# Altium project ANE_0002_01AA.PrjPCB (part 4 of 4)

## Sheet Battery_Charger.SchDoc
size A3; DocumentNumber: 9; SheetNumber: 9; SheetTotal: 11
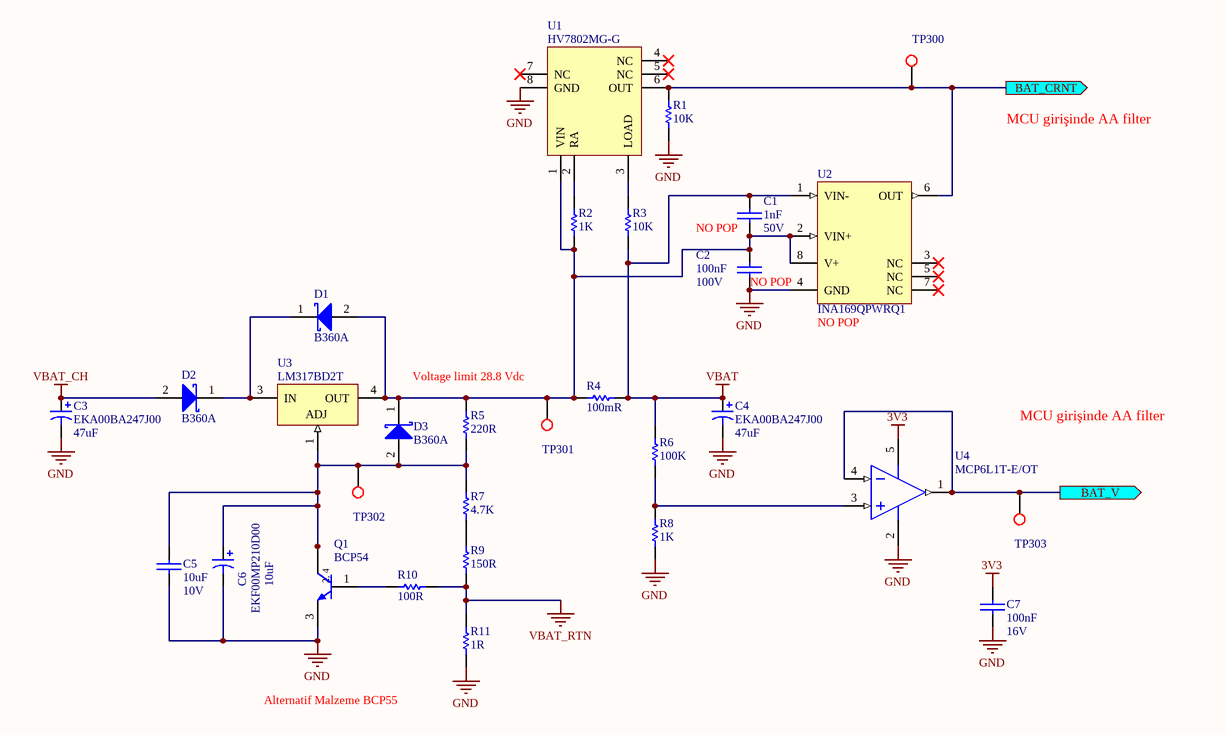
[diagram p10: Battery_Charger.SchDoc]

### Parts
C1  Operating Voltage: 50V  Assembly: NO POP  [CAPC1005X06N]  (hidden comment: 1nF)
C2  Operating Voltage: 100V  Assembly: NO POP  [CAPC3216X09N]  (hidden comment: 100nF)
C3  EKA00BA247J00  value 47uF  [CAPPR2.5-6.3X11]
C4  EKA00BA247J00  value 47uF  [CAPPR2.5-6.3X11]
C5  Operating Voltage: 10V  [CAPC2012X09N]  (hidden comment: 10uF)
C6  EKF00MP210D00  value 10uF  [CAPPR1.5-4X5]
C7  Operating Voltage: 16V  [CAPC1005X06N]  (hidden comment: 100nF)
D1  B360A  [DIOM5226X23N]
D2  B360A  [DIOM5226X23N]
D3  B360A  [DIOM5226X23N]
Q1  BCP54  [SOT-223B_N]
R1  10K  [RESC1005X04N]
R2  1K  [RESC1005X04N]
R3  10K  [RESC1005X04N]
R4  100mR  [RESC3216X08N]
R5  220R  [RESC2012X07N]
R6  100K  [RESC1005X04N]
R7  4.7K  [RESC2012X07N]
R8  1K  [RESC1005X04N]
R9  150R  [RESC2012X07N]
R10  100R  [RESC2012X07N]
R11  1R  [RESC3225X06N]
TP300  AEMT-C00S-1000-0000  [TP100]  (value not drawn)
TP301  AEMT-C00S-1000-0000  [TP100]  (value not drawn)
TP302  AEMT-C00S-1000-0000  [TP100]  (value not drawn)
TP303  AEMT-C00S-1000-0000  [TP100]  (value not drawn)
U1  HV7802MG-G  [MSOP65P490X110-8N]
U2  Assembly: NO POP  [TSOP65P640X120-8N]  (hidden comment: INA169QPWRQ1)
U3  LM317BD2T  [936-03]
U4  MCP6L1T-E/OT  [SOT-23-OT5_N]

### Ports
BAT_CRNT (out), BAT_V (out)

### Nets
3V3: C7.2 U4.5(VDD)
GND: C2.1 C3.2 C4.2 C5.1 C6.2 C7.1 Q1.3(E) R1.1 R8.1 R11.1 U1.8(GND) U2.4(GND) U4.2(VSS)
VBAT: C1.2 C4.1 R3.1 R4.2 R6.2 U2.1(VIN-)
VBAT_CH: C3.1 D2.2(A)
VBAT_RTN: R9.1 R10.2 R11.2
BAT_CRNT: R1.2 TP300.1 U1.6(OUT) U2.6(OUT) ; port BAT_CRNT
BAT_V: TP303.1 U4.1(VOUT) U4.4(VIN-) ; port BAT_V
NetC1_1: C1.1 C2.2 D1.2(A) D3.1(K) R2.1 R4.1 R5.2 TP301.1 U1.1(VIN) U2.2(VIN+) U2.8(V+) U3.4(OUT)
NetC5_2: C5.2 C6.1 D3.2(A) Q1.2(C) Q1.4(C) R5.1 R7.2 TP302.1 U3.1(ADJ)
NetD1_1: D1.1(K) D2.1(K) U3.3(IN)
NetQ1_1: Q1.1(B) R10.1
NetR2_2: R2.2 U1.2(RA)
NetR3_2: R3.2 U1.3(LOAD)
NetR6_1: R6.1 R8.2 U4.3(VIN+)
NetR7_1: R7.1 R9.2

Not connected (* = marked no-connect by the designer): U1 4(NC)* 5(NC)* 7(NC)*; U2 3(NC)* 5(NC)* 7(NC)*

### Notes on the sheet
- MCU girişinde AA filter
- Voltage limit 28.8 Vdc
- Alternatif Malzeme BCP55
- Title
- Size:
- Date:
- A3
- Number:
- Time:
- Revision:
- Sheet
- of
- File:
- (in symbol BCP54) 2, 4

### Library data of the parts
C1 = ACC0-0100-S272-0000: CAP, CER, C0G, 1nF, %5, 50V, 0402; Manufacturer: Murata; Manufacturer Part Number: GRM1555C1H102JA01D; CR: 000049; Requested by: MU; Lead Finish: Pb Free; Material: Ceramic, C0G; Definition Date: 14.08.2012; Revision Date: *; Price: *; Supplier: *; Supplier Part Number: *; DS: 000049; Operating Temp: -55 to 125 C; Storage Temp: -55 to 125 C; Status: Active; Package Reference: EIA 0402, Metric 1005; Component Type: Capacitor; Footprint Type: SMD; Published by: MU; ESR: *; FR: *; Value: 1nF
C2 = ACC7-2100-S791-0000: CAP, CER, X7R, 100nF, %10, 100V, 1206; Manufacturer: KEMET; Manufacturer Part Number: C1206C104K1RACTU; CR: 000211/89; Requested by: OO; DS: 000211; Lead Finish: Pb Free; Published by: MU; Material: Ceramic, X7R; Definition Date: 18.02.2013; Revision Date: *; Price: *; Supplier: *; Supplier Part Number: *; Operating Temp: -55 to 125 C; Storage Temp: -55 to 125 C; Status: Active; Package Reference: EIA 1206, Metric 3216; Component Type: Capacitor; Footprint Type: SMD; ESR: *; FR: *; Value: 100nF
C3 C4 = EKA00BA247J00: Aluminum Electrolytic Capacitor, Radial Style with Long Leads: 47uF, 63V; Note: Refer to Manufacturer's Data Sheets for other lead formations; DrillSize: Nominal, Rounded To The Nearest 0.1mm; Published: 19-Mar-2004; DatasheetDocument: 20-Feb-2001; PackageReference: CAPPR2.5-6.3X11; Publisher: Altium Limited; ComponentLink1Description: Manufacturer Link; ComponentLink1URL: http://www.vishay.com/; ComponentLink2Description: Datasheet; ComponentLink2URL: http://www.vishay.com/docs/25014/eka.pdf
C5 = ACC7-4100-S431-0000: CAP, CER, X7R, 10uF, %10, 10V, 0805; Manufacturer: Murata; Manufacturer Part Number: GRM21BR71A106KE51L; CR: 000049; Requested by: MAY; Lead Finish: Pb Free; Published by: MU; Material: Ceramic, X7R; Definition Date: 22.10.2012; Revision Date: *; Price: *; Supplier: *; Supplier Part Number: *; DS: 000049; Operating Temp: -55 to 125 C; Storage Temp: -55 to 125 C; Status: Active; Package Reference: EIA 0805, Metric 2012; Component Type: Capacitor; Footprint Type: SMD; ESR: *; FR: *; Value: 10uF
C6 = EKF00MP210D00: Aluminum Electrolytic Capacitor, Radial Style with Long Leads: 10uF, 16V; Note: Refer to Manufacturer's Data Sheets for other lead formations; DrillSize: Nominal, Rounded To The Nearest 0.05mm; Published: 19-Mar-2004; DatasheetDocument: 13-Jan-2000; PackageReference: CAPPR1.5-4X5; Publisher: Altium Limited; ComponentLink1Description: Manufacturer Link; ComponentLink1URL: http://www.vishay.com/; ComponentLink2Description: Datasheet; ComponentLink2URL: http://www.vishay.com/docs/25004/ekf.pdf
C7 = ACC7-2100-S241-0000: CAP, CER, X7R, 100nF, %10, 16V, 0402; Manufacturer: Murata; Manufacturer Part Number: GRM155R71C104KA88D; CR: 000049; Requested by: MU; Lead Finish: Pb Free; Material: Ceramic, X7R; Definition Date: 14.08.2012; Revision Date: *; Price: *; Supplier: *; Supplier Part Number: *; DS: 000049; Operating Temp: -55 to 125 C; Storage Temp: -55 to 125 C; Status: Active; Package Reference: EIA 0402, Metric 1005; Component Type: Capacitor; Footprint Type: SMD; Published by: MU; ESR: *; FR: *; Value: 100nF
D1-D3 = AS15-930M-SI60-0001: Diode, Schottky, 0.7V @3A, 60V, SMA; Manufacturer Part Number: B360A-13-F; Manufacturer: Diodes; CR: 000101; Lead Finish: Pb Free; Published by: MU; Requested by: TK; Price: *; DS: 000101; Definition Date: 22.03.2013; Footprint Type: SMD; JEDEC Code: *; Operating Temp: -55 to 150 C; Package Reference: SMA; Revision Date: *; Status: Active; Storage Temp: -55 to 150 C; Supplier: *; Supplier Part Number: *; Component Type: DIODE; Forward Voltage: 0.7V @3A; Reverse Voltage: 60V; Value: B360A
Q1 = BCP54: NPN General Purpose Amplifier; Published: 8-Jun-2000; LatestRevisionDate: 20-Nov-2009; LatestRevisionNote: IPC-7351 Footprint Added.; DatasheetVersion: 1997; PackageVersion: Aug-1999; PackageReference: SOT-223B; Publisher: Altium Limited; PackageDescription: 4-Pin SOT-223 Package 2.3 mm Pitch, 7 mm Lead Span; ComponentLink1Description: Manufacturer Link; ComponentLink1URL: http://www.fairchildsemi.com/; ComponentLink2Description: Datasheet; ComponentLink2URL: http://www.fairchildsemi.com/ds/BC%2FBCP54.pdf
R1 R3 = AR19-4100-S2B2-0000: RES, E24, Thick Film, SMD, 10K, 1%, 0.1W, 0402; Manufacturer: Panasonic; Manufacturer Part Number: ERJ-2RKF1002X; CR: DS00073; Requested by: MU; Lead Finish: Pb Free; Max. Operating Voltage: 50V; Definition Date: 16.08.2012; Revision Date: *; Price: *; Supplier: *; Supplier Part Number: *; DS: DS00073; Operating Temp: -55 to 155 C; Storage Temp: -55 to 155 C; Status: Active; Package Reference: EIA 0402, Metric 1005; Component Type: Resistor; Footprint Type: SMD; Published by: MU; JEDEC Code: *; Material: Thick Film; ESR: *; FR: *; Power Rating: 0.1W; Value: 10K
R2 R8 = AR19-3100-S2B2-0000: RES, E24, Thick Film, SMD, 1K, 1%, 0.1W, 0402; Manufacturer: Panasonic; Manufacturer Part Number: ERJ-2RKF1001X; CR: DS00073; Requested by: MU; Lead Finish: Pb Free; Max. Operating Voltage: 50V; Definition Date: 16.08.2012; Revision Date: *; Price: *; Supplier: *; Supplier Part Number: *; DS: DS00073; Operating Temp: -55 to 155 C; Storage Temp: -55 to 155 C; Status: Active; Package Reference: EIA 0402, Metric 1005; Component Type: Resistor; Footprint Type: SMD; Published by: MU; JEDEC Code: *; Material: Thick Film; ESR: *; FR: *; Power Rating: 0.1W; Value: 1K
R4 = AR19-Z100-S5D2-0000: RES, Thick Film, SMD, 100mR, 1%, 1W, 1206; Manufacturer: Panasonic; Manufacturer Part Number: ERJ-8BWFR100V; CR: 000078; Requested by: MU; Lead Finish: Pb Free; Max. Operating Voltage: 0.40; Definition Date: 14.02.2013; Revision Date: *; Price: *; Supplier: *; Supplier Part Number: *; DS: 000078; Operating Temp: -55 to 155 C; Storage Temp: -55 to 155 C; Status: Active; Package Reference: EIA 1206, Metric 3216; Component Type: Resistor; Footprint Type: SMD; Published by: MU; JEDEC Code: *; Material: Thick Film; ESR: *; FR: *; Power Rating: 1W; Value: 100mR
R5 = AR19-2220-S4B2-0000: RES, E24, Thick Film, SMD, 220R, 1%, 0.125W, 0805; Manufacturer: Panasonic; Manufacturer Part Number: ERJ-6ENF2200V; CR: DS00073; Requested by: MAY; Lead Finish: Pb Free; Published by: MU; Max. Operating Voltage: 150V; Definition Date: 09.11.2012; Revision Date: *; Price: *; Supplier: *; Supplier Part Number: *; DS: DS00073; Operating Temp: -55 to 155 C; Storage Temp: -55 to 155 C; Status: Active; Package Reference: EIA 0805, Metric 2012; Component Type: Resistor; Footprint Type: SMD; JEDEC Code: *; Material: Thick Film; ESR: *; FR: *; Power Rating: 0.125W; Value: 220R
R6 = AR19-5100-S2B2-0000: RES, E24, Thick Film, SMD, 100K, 1%, 0.1W, 0402; Manufacturer: Panasonic; Manufacturer Part Number: ERJ-2RKF1003X; CR: DS00073; Requested by: MU; Lead Finish: Pb Free; Max. Operating Voltage: 50V; Definition Date: 16.08.2012; Revision Date: *; Price: *; Supplier: *; Supplier Part Number: *; DS: DS00073; Operating Temp: -55 to 155 C; Storage Temp: -55 to 155 C; Status: Active; Package Reference: EIA 0402, Metric 1005; Component Type: Resistor; Footprint Type: SMD; Published by: MU; JEDEC Code: *; Material: Thick Film; ESR: *; FR: *; Power Rating: 0.1W; Value: 100K
R7 = AR19-3470-S4B2-0000: RES, E24, Thick Film, SMD, 4.7K, 1%, 0.125W, 0805; Manufacturer: Panasonic; Manufacturer Part Number: ERJ-6ENF4701V; CR: 000073; Requested by: OO; Lead Finish: Pb Free; Published by: MU; Max. Operating Voltage: 150V; Definition Date: 16.02.2013; Revision Date: *; Price: *; Supplier: *; Supplier Part Number: *; DS: 000073; Operating Temp: -55 to 155 C; Storage Temp: -55 to 155 C; Status: Active; Package Reference: EIA 0805, Metric 2012; Component Type: Resistor; Footprint Type: SMD; JEDEC Code: *; Material: Thick Film; ESR: *; FR: *; Power Rating: 0.125W; Value: 4.7K
R9 = AR19-2150-S4B2-0000: RES, E24, Thick Film, SMD, 150R, 1%, 0.125W, 0805; Manufacturer: Panasonic; Manufacturer Part Number: ERJ-6ENF1500V; CR: DS00073; Requested by: MAY; Lead Finish: Pb Free; Published by: MU; Max. Operating Voltage: 150V; Definition Date: 09.11.2012; Revision Date: *; Price: *; Supplier: *; Supplier Part Number: *; DS: DS00073; Operating Temp: -55 to 155 C; Storage Temp: -55 to 155 C; Status: Active; Package Reference: EIA 0805, Metric 2012; Component Type: Resistor; Footprint Type: SMD; JEDEC Code: *; Material: Thick Film; ESR: *; FR: *; Power Rating: 0.125W; Value: 150R
R10 = AR19-2100-S4B2-0000: RES, E24, Thick Film, SMD, 100R, 1%, 0.125W, 0805; Manufacturer: Panasonic; Manufacturer Part Number: ERJ-6ENF1000V; CR: DS00073; Requested by: MAY; Lead Finish: Pb Free; Published by: MU; Max. Operating Voltage: 150V; Definition Date: 09.11.2012; Revision Date: *; Price: *; Supplier: *; Supplier Part Number: *; DS: DS00073; Operating Temp: -55 to 155 C; Storage Temp: -55 to 155 C; Status: Active; Package Reference: EIA 0805, Metric 2012; Component Type: Resistor; Footprint Type: SMD; JEDEC Code: *; Material: Thick Film; ESR: *; FR: *; Power Rating: 0.125W; Value: 100R
R11 = AR19-0100-S6B2-0000: RES, Thick Film, SMD, 1R, 1%, 0.5W, 1210; Manufacturer: Vishay; Manufacturer Part Number: CRCW12101R00FKEA; CR: 000234/117; Requested by: NK; DS: 000234; Lead Finish: Pb Free; Published by: MU; Max. Operating Voltage: 200; Definition Date: 27.02.2013; Revision Date: *; Price: *; Supplier: *; Supplier Part Number: *; Operating Temp: -55 to 155 C; Storage Temp: -55 to 155 C; Status: Active; Package Reference: EIA 1210, Metric 3226; Component Type: Resistor; Footprint Type: SMD; JEDEC Code: *; Material: Thick Film; ESR: *; FR: *; Power Rating: 0.5W; Value: 1R
TP300-TP303 = AEMT-C00S-1000-0000: Test Point, Circular, 1mm; Text: TEST_POINT
U1 = AT82-0000-SMC0-1860: IC, PMIC, Current Monitor, HV7802MG-G, MSOP-8; Manufacturer: Microchip; JEDEC Code: MO-187; Lead Finish: Pb Free; Published by: NK; Component Type: IC; CR: -; Definition Date: 01.08.2015; DS: -; Footprint Type: SMD; Manufacturer Part Number: HV7802MG-G; Operating Temp: -40°C to 85°C; Package Reference: MSOP-8; Price: *; Requested by: NK; Revision Date: -; Status: Active; Storage Temp: -65°C to 150°C; Supplier: *; Supplier Part Number: *; FR: *; Value: HV7802MG-G
U2 = AT82-0000-SM90-0690: IC, PMIC, Current Monitor, INA169QPWRQ1, TSSOP-8; Manufacturer: Texas Instruments; CR: 000177; JEDEC Code: MO-153; Lead Finish: Pb Free; Published by: MU; Requested by: OO; Component Type: IC; Definition Date: 20.12.2012; DS: 000177; Footprint Type: SMD; Manufacturer Part Number: INA169QPWRQ1; Operating Temp: -40°C to 125°C; Package Reference: TSSOP-8; Price: *; Revision Date: 27.05.2013; Status: Active; Storage Temp: -65°C to 150°C; Supplier: *; Supplier Part Number: *; FR: *; Value: INA169QPWRQ1
U3 = LM317BD2T: Three-Terminal Adjustable Output Positive Voltage Regulator; Note: Pin 2 is electrically connected to Pin 4; Pin 4 is heasink; Published: 15-Apr-2002; DatasheetVersion: 1996; PackageVersion: 1997; PackageReference: 936-03; Publisher: Altium Limited; PackageDescription: D2-PAK/TO-263-AB; 3 Leads (1 Cropped); Body 14.7 (inc. leads) x 10.2 mm (LxW max); ComponentLink1Description: Manufacturer Link; ComponentLink1URL: http://www.onsemi.com/site/products/taxonomy/0,4438,503,00.html; ComponentLink2Description: Datasheet; ComponentLink2URL: http://www.onsemi.com/pub/Collateral/LM317-D.PDF
U4 = MCP6L1T-E/OT: 2.8 MHz, 200 µA Op Amp, 5-Pin SOT-23, Extended Temperature Range, Tape and Reel; Manufacturer: Microchip; DatasheetVersion: revC, Jan-2012; PackageVersion: revBB, Aug-2009; PackageReference: SOT-23-OT5; PackageDescription: 5-Lead Plastic Small Outline Transistor (OT) [SOT-23]; Supplier 1: Digi-Key; Supplier Part Number 1: MCP6L1T-E/OTTR-ND; Supplier 2: Digi-Key; Supplier Part Number 2: MCP6L1T-E/OTCT-ND; Supplier 3: Digi-Key; Supplier Part Number 3: MCP6L1T-E/OTDKR-ND; Supplier 4: Newark; Supplier Part Number 4: 06R3494; Supplier 5: Mouser; Supplier Part Number 5: 579-MCP6L1T-E/OT; Mounting Technology: Surface Mount; Code_IPC: SOT23-5; PartNumber: MCP6L1T-E/OT; ComponentLink1Description: Manufacturer URL; ComponentLink1URL: http://www.microchip.com/; ComponentLink2Description: Datasheet; ComponentLink2URL: http://ww1.microchip.com/downloads/en/DeviceDoc/22135C.pdf; ComponentLink3Description: Package Specification; ComponentLink3URL: http://www.microchip.com/stellent/groups/techpub_sg/documents/packagingspec/en012702.pdf

## Nets that join several sheets
3V3: Motor_Driver (5 pins), RS232_Interface (6 pins), RS485_Interface (C605.1 R602.2 U601.8), Optocoupler_Interface (11 pins), MCU (L202.2), Buck_Converter (R315.2 R318.2 TP309.1), Connectors (R101.1 R103.1), Battery_Charger (C7.2 U4.5)
5V0: MCU (J201.1), Buck_Converter (6 pins), Connectors (R100.1 R102.1)
GND: Main (D100.2 J106.3 TP101.1), Motor_Driver (22 pins), RS232_Interface (14 pins), RS485_Interface (C605.2 D604.3 R605.1 U601.5), Optocoupler_Interface (20 pins), MCU (32 pins), Relay_Interface (6 pins), Boost_Converter (16 pins), Buck_Converter (31 pins), Connectors (9 pins), Battery_Charger (13 pins)
MCU_VBAT: MCU (D200.1 R210.1), Connectors (BH100.1)
VBAT: Main (J106.1 TP104.1), Battery_Charger (6 pins)
VBAT_CH: Relay_Interface (F501.1), Boost_Converter (5 pins), Battery_Charger (C3.1 D2.2)
VBAT_RTN: Main (J106.2 TP103.1), Battery_Charger (R9.1 R10.2 R11.2)
VDC_FTCLL: Buck_Converter (C322.2 U305.4), Connectors (J100.1)
VDC_IN: Main (F100.2 TP102.1), Motor_Driver (11 pins), Optocoupler_Interface (22 pins), Relay_Interface (5 pins), Boost_Converter (5 pins), Buck_Converter (17 pins)
VDC_RDR1: Buck_Converter (C318.2 U303.4), Connectors (J100.4)
VDC_RDR2: Buck_Converter (C320.2 U304.4), Connectors (J100.7)
3V3_PG: MCU (U201.2), Buck_Converter (R318.1 U301.3)
AUX1_OG_IN: Optocoupler_Interface (D508.3), Connectors (J101.3)
AUX1_TTL: Optocoupler_Interface (R531.1 TP509.1 U509.4), MCU (U200.53)
AUX2_OG_IN: Optocoupler_Interface (D509.3), Connectors (J101.4)
AUX2_TTL: Optocoupler_Interface (R535.1 TP511.1 U511.4), MCU (U200.54)
AUX3_OG_IN: Optocoupler_Interface (D510.3), Connectors (J101.6)
AUX3_TTL: Optocoupler_Interface (R539.1 TP512.1 U512.4), MCU (U200.55)
AUX4_OG_IN: Optocoupler_Interface (D507.3), Connectors (J101.7)
AUX4_TTL: Optocoupler_Interface (R528.1 TP508.1 U508.4), MCU (U200.56)
AUX5_TTL: Optocoupler_Interface (R538.1 TP510.1), MCU (U200.50)
AUX_OG_IN_RTN: Optocoupler_Interface (R534.1), Connectors (J101.5 J101.8)
BAT_CHRG: MCU (R209.1), Boost_Converter (R312.2)
BAT_CRNT: MCU (U200.36), Battery_Charger (R1.2 TP300.1 U1.6 U2.6)
BAT_MAINTAIN: MCU (R206.1), Boost_Converter (R311.2)
BAT_V: MCU (U200.11), Battery_Charger (TP303.1 U4.1 U4.4)
EMRGNCY_OG_IN: Optocoupler_Interface (D500.3), Connectors (J102.6)
EMRGNCY_TTL: Optocoupler_Interface (R500.1 TP500.1 U500.4), MCU (U200.45)
FTCLL_OG_IN: Optocoupler_Interface (D505.3), Connectors (J100.3)
FTCLL_TTL: Optocoupler_Interface (R521.1 TP506.1 U506.4), MCU (U200.28)
LAMP_ENA: MCU (U200.29), Relay_Interface (R545.2 TP514.1)
MECH_LOCK_ENA: MCU (U200.40), Relay_Interface (R543.2 TP513.1)
MECH_LOCK_TTL: Optocoupler_Interface (R513.1 TP504.1 U504.4), MCU (U200.38)
MECH_UNLOCK_OG_IN: Optocoupler_Interface (D506.3), Connectors (J102.5)
MECH_UNLOCK_TTL: Optocoupler_Interface (R524.1 TP507.1 U507.4), MCU (U200.39)
MTR_CRNT: Motor_Driver (R400.2 U400.6 U401.6), MCU (U200.9)
MTR_EN_MCU: Motor_Driver (R410.1 U402.14), MCU (U200.20)
MTR_FLT_MCU: Motor_Driver (R407.1 U402.9), MCU (U200.26)
MTR_iDRV_MCU: Motor_Driver (C406.2 R415.2 R422.1), MCU (U200.18)
MTR_PH_MCU: Motor_Driver (R409.1 U402.15), MCU (U200.21)
MTR_SLP_MCU: Motor_Driver (R408.1 U402.13), MCU (U200.35)
MTR_SNS_MCU: Motor_Driver (R406.1 U402.10), MCU (U200.44)
MTR_SO_MCU: Motor_Driver (R417.1 R418.1), MCU (U200.37)
NetD503_3: Optocoupler_Interface (D503.3), Connectors (J102.3)
NetJ100_2: Optocoupler_Interface (R527.2), Connectors (J100.2)
NetJ100_5: Optocoupler_Interface (R512.2), Connectors (J100.5)
NetJ100_8: Optocoupler_Interface (R519.2), Connectors (J100.8)
NetJ101_1: Relay_Interface (SW501.1), Connectors (J101.1)
NetJ101_2: Relay_Interface (SW501.3), Connectors (J101.2)
NetJ101_9: Optocoupler_Interface (U510.3), Connectors (J101.9)
NetJ101_10: Optocoupler_Interface (U510.4), Connectors (J101.10)
NetJ102_1: Relay_Interface (SW500.3), Connectors (J102.1)
NetJ102_4: Optocoupler_Interface (R520.1), Connectors (J102.4)
NetJ102_7: Optocoupler_Interface (R506.2), Connectors (J102.7)
NetJ102_9: Optocoupler_Interface (R507.1), Connectors (J102.9)
NetJ102_10: Optocoupler_Interface (U503.3), Connectors (J102.10)
NetJ102_11: Optocoupler_Interface (U503.4), Connectors (J102.11)
NXT_DOOR_TTL: Optocoupler_Interface (R511.1 TP503.1), MCU (U200.46)
PRE_DOOR_OG_IN: Optocoupler_Interface (D501.3), Connectors (J102.8)
PRE_DOOR_TTL: Optocoupler_Interface (R503.1 TP501.1 U501.4), MCU (U200.49)
RDR_1_OG_IN: Optocoupler_Interface (D502.3), Connectors (J100.6)
RDR_1_TTL: Optocoupler_Interface (R508.1 TP502.1 U502.4), MCU (U200.5)
RDR_2_OG_IN: Optocoupler_Interface (D504.3), Connectors (J100.9)
RDR_2_TTL: Optocoupler_Interface (R516.1 TP505.1 U505.4), MCU (U200.6)
RS232_1_CTS: RS232_Interface (R601.1 TP600.1), MCU (U200.62)
RS232_1_RTS: RS232_Interface (TP602.1 U600.10), MCU (U200.61)
RS232_1_RX: RS232_Interface (D601.2 U600.13), Connectors (J103.1 J104.1)
RS232_1_RXD: RS232_Interface (R600.1 TP601.1), MCU (U200.63)
RS232_1_TX: RS232_Interface (D603.2 U600.14), Connectors (J103.4 J104.4)
RS232_1_TXD: RS232_Interface (TP603.1 U600.11), MCU (U200.64)
RS232_2_CTS: RS232_Interface (R607.1), MCU (R207.1)
RS232_2_RTS: RS232_Interface (U602.10), MCU (R208.1)
RS232_2_RX: RS232_Interface (D600.2 U600.8), Connectors (J103.5 J104.5)
RS232_2_RXD: RS232_Interface (R606.1), MCU (U200.2)
RS232_2_TX: RS232_Interface (D602.2 U600.7), Connectors (J103.2 J104.2)
RS232_2_TXD: RS232_Interface (U602.11), MCU (U200.1)
RS232_3_RX: RS232_Interface (D606.2 U602.13), Connectors (J105.3)
RS232_3_TX: RS232_Interface (D608.2 U602.14), Connectors (J105.2)
RS232_4_RX: RS232_Interface (D605.2 U602.8), Connectors (J108.2)
RS232_4_TX: RS232_Interface (D607.2 U602.7), Connectors (J108.1)
RS422_DE: RS485_Interface (TP606.1 U601.3), MCU (U200.57)
RS422_RE_L: RS485_Interface (TP609.1 U601.2), MCU (U200.58)
RS422_RTX_N: RS485_Interface (5 pins), Connectors (J107.4)
RS422_RTX_P: RS485_Interface (5 pins), Connectors (J107.5)
RS422_RXD: RS485_Interface (R603.1 TP608.1), MCU (U200.59)
RS422_TXD: RS485_Interface (TP607.1 U601.4), MCU (U200.60)
VBAT_CH_SNS: MCU (U200.19), Boost_Converter (R304.1 R310.2 TP305.1)

## Assembly variants
AB00 0006 01AC 0000: all parts fitted
AB00 0006 01AC 0001: not fitted C406 C506 C1115 C2604 C2605 C2606 C2607 C2700_1 C2700_2 C2700_3 C2700_4 C2701_1 C2701_2 C2701_3 C2701_4 C2702_1 C2702_2 C2702_3 C2702_4 C2703_1 C2703_2 C2703_3 C2703_4 C2704_1 C2704_2 C2704_3 C2704_4 D1105 D2701_1 D2701_2 D2701_3 D2701_4 J1801 L1000 L2700_1 L2700_2 L2700_3 L2700_4 Q2102 R515 R803 R812 R813 R814 R831 R834 R835 R1000 R1001 R1002 R1003 R1005 R1006 R1007 R1008 R1009 R1017 R1018 R1019 R1025 R1026 R1027 R1028 R1035 R1036 R1037 R1108_1 R1108_2 R1116 R1117 R1118 R1119 R1120 R1121 R1123 R1124 R1129 R1130 R1132 R1203_1 R1203_2 R1203_3 R1303_1 R1303_2 R1303_3 R1303_4 R1311 R1312 R1405_1 R1405_2 R1406_1 R1406_2 R1702 R1803 R2109 R2403_1 R2403_2 R2403_3 R2403_4 R2406_1 R2406_2 R2406_3 R2406_4 R2607 R2609 R2623 R2624 R2700_1 R2700_2 R2700_3 R2700_4 R2701_1 R2701_2 R2701_3 R2701_4 R2702_1 R2702_2 R2702_3 R2702_4 R2703_1 R2703_2 R2703_3 R2703_4 R2704_1 R2704_2 R2704_3 R2704_4 R2800 R2801 R2802 R2803 R2804 R2805 R2806 R2807 U1000 U1001 U1104 U2700_1 U2700_2 U2700_3 U2700_4 U2701_1 U2701_2 U2701_3 U2701_4